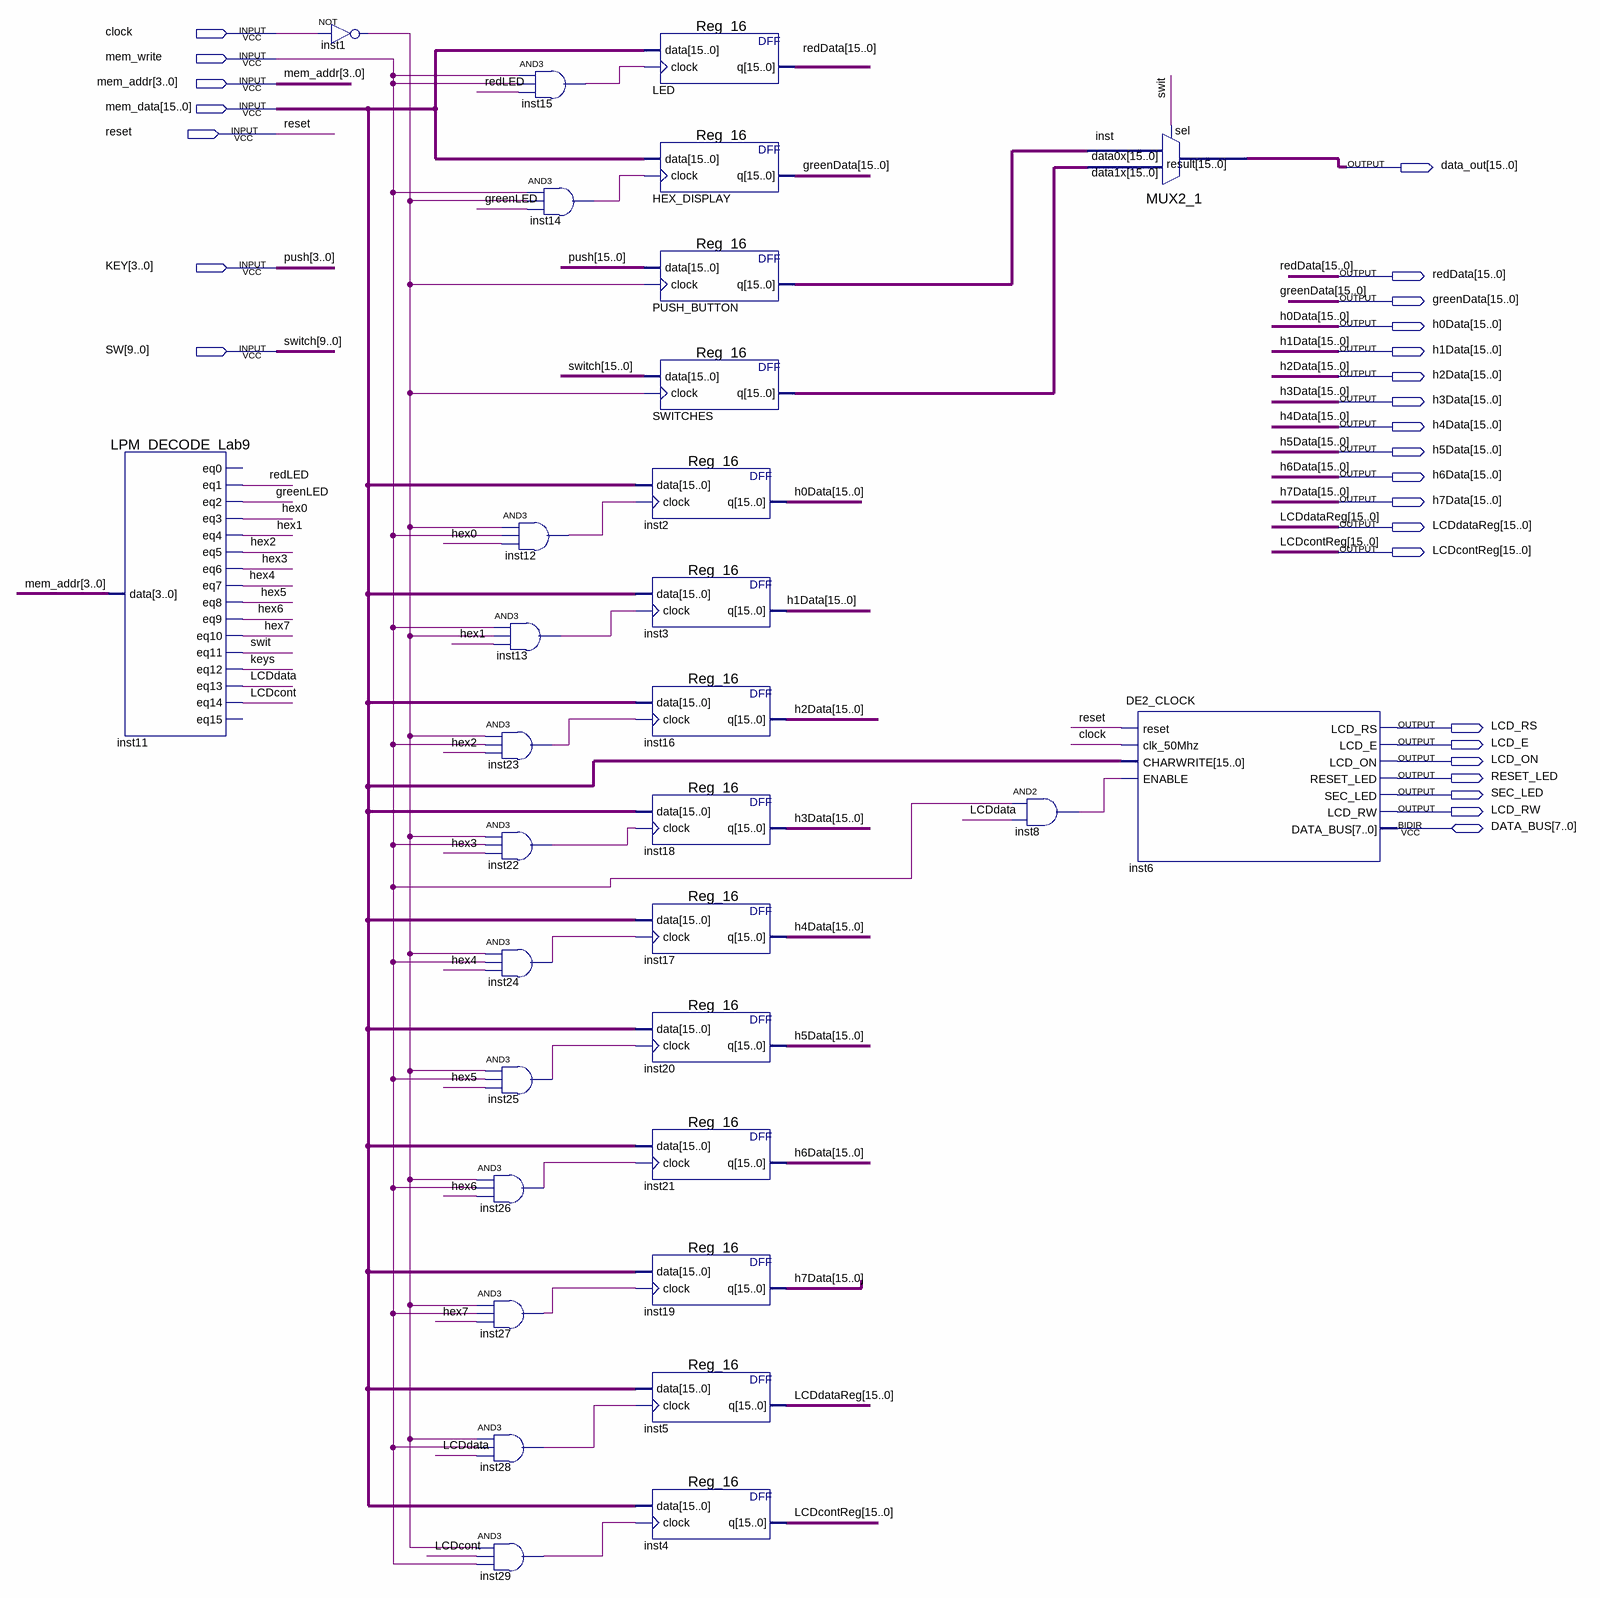
[diagram p0: schematic sheet]
// Quartus schematic IO_MemoryInterface.bdf as structural Verilog: 31 symbols, 27 pins
module IO_MemoryInterface (
  input  clock,
  input  mem_write,
  input  [3:0] mem_addr,
  input  [15:0] mem_data,
  input  reset,
  input  [3:0] KEY,
  input  [9:0] SW,
  inout  [7:0] DATA_BUS,
  output [15:0] data_out,
  output [15:0] redData,
  output [15:0] greenData,
  output [15:0] h0Data,
  output [15:0] h1Data,
  output [15:0] h2Data,
  output [15:0] h3Data,
  output [15:0] h4Data,
  output [15:0] h5Data,
  output [15:0] h6Data,
  output [15:0] h7Data,
  output [15:0] LCDdataReg,
  output [15:0] LCDcontReg,
  output LCD_RS,
  output LCD_E,
  output LCD_ON,
  output RESET_LED,
  output SEC_LED,
  output LCD_RW
);

  wire greenLED, hex0, hex1, hex2, hex3, hex4, hex5, hex6, hex7, inst1_out, inst8_out, inst12_out,
       inst13_out, inst14_out, inst15_out, inst22_out, inst23_out, inst24_out, inst25_out, inst26_out,
       inst27_out, inst28_out, inst29_out, keys, LCDcont, LCDdata, redLED, swit;
  wire [15:0] PUSH_BUTTON_q, SWITCHES_q;
  wire [15:4] push;
  wire [15:10] switch;

  LPM_DECODE_Lab9 inst11 (
    .data(mem_addr), .eq1(redLED), .eq2(greenLED), .eq3(hex0), .eq4(hex1), .eq5(hex2), .eq6(hex3),
    .eq7(hex4), .eq8(hex5), .eq9(hex6), .eq10(hex7), .eq11(swit), .eq12(keys), .eq13(LCDdata), .eq14(LCDcont));  // open: eq0, eq15
  not inst1 (inst1_out, clock);
  and inst12 (inst12_out, inst1_out, mem_write, hex0);
  and inst13 (inst13_out, mem_write, inst1_out, hex1);
  and inst23 (inst23_out, inst1_out, mem_write, hex2);
  and inst22 (inst22_out, inst1_out, mem_write, hex3);
  and inst24 (inst24_out, inst1_out, mem_write, hex4);
  and inst25 (inst25_out, inst1_out, mem_write, hex5);
  and inst26 (inst26_out, inst1_out, mem_write, hex6);
  and inst27 (inst27_out, inst1_out, mem_write, hex7);
  and inst28 (inst28_out, inst1_out, mem_write, LCDdata);
  and inst29 (inst29_out, inst1_out, LCDcont, mem_write);
  and inst15 (inst15_out, mem_write, mem_write, redLED);
  and inst14 (inst14_out, mem_write, inst1_out, greenLED);
  Reg_16 LED (.data(mem_data), .clock(inst15_out), .q(redData));
  Reg_16 HEX_DISPLAY (.data(mem_data), .clock(inst14_out), .q(greenData));
  Reg_16 PUSH_BUTTON (.data({push, KEY}), .clock(inst1_out), .q(PUSH_BUTTON_q));
  Reg_16 SWITCHES (.data({switch, SW}), .clock(inst1_out), .q(SWITCHES_q));
  Reg_16 inst2 (.data(mem_data), .clock(inst12_out), .q(h0Data));
  Reg_16 inst3 (.data(mem_data), .clock(inst13_out), .q(h1Data));
  Reg_16 inst16 (.data(mem_data), .clock(inst23_out), .q(h2Data));
  Reg_16 inst18 (.data(mem_data), .clock(inst22_out), .q(h3Data));
  Reg_16 inst17 (.data(mem_data), .clock(inst24_out), .q(h4Data));
  Reg_16 inst20 (.data(mem_data), .clock(inst25_out), .q(h5Data));
  Reg_16 inst21 (.data(mem_data), .clock(inst26_out), .q(h6Data));
  Reg_16 inst19 (.data(mem_data), .clock(inst27_out), .q(h7Data));
  Reg_16 inst5 (.data(mem_data), .clock(inst28_out), .q(LCDdataReg));
  Reg_16 inst4 (.data(mem_data), .clock(inst29_out), .q(LCDcontReg));
  and inst8 (inst8_out, mem_write, LCDdata);
  MUX2_1 inst (.data1x(SWITCHES_q), .data0x(PUSH_BUTTON_q), .sel(swit), .result(data_out));
  DE2_CLOCK inst6 (
    .reset(reset), .clk_50Mhz(clock), .CHARWRITE(mem_data), .ENABLE(inst8_out), .LCD_RS(LCD_RS),
    .LCD_E(LCD_E), .LCD_ON(LCD_ON), .RESET_LED(RESET_LED), .SEC_LED(SEC_LED), .LCD_RW(LCD_RW),
    .DATA_BUS(DATA_BUS));

  // Other names for the same wires on the sheet: push[3:0] = KEY; switch[9:0] = SW
endmodule
